# Altium schematic sheet PCBSchematic.SchDoc
size A
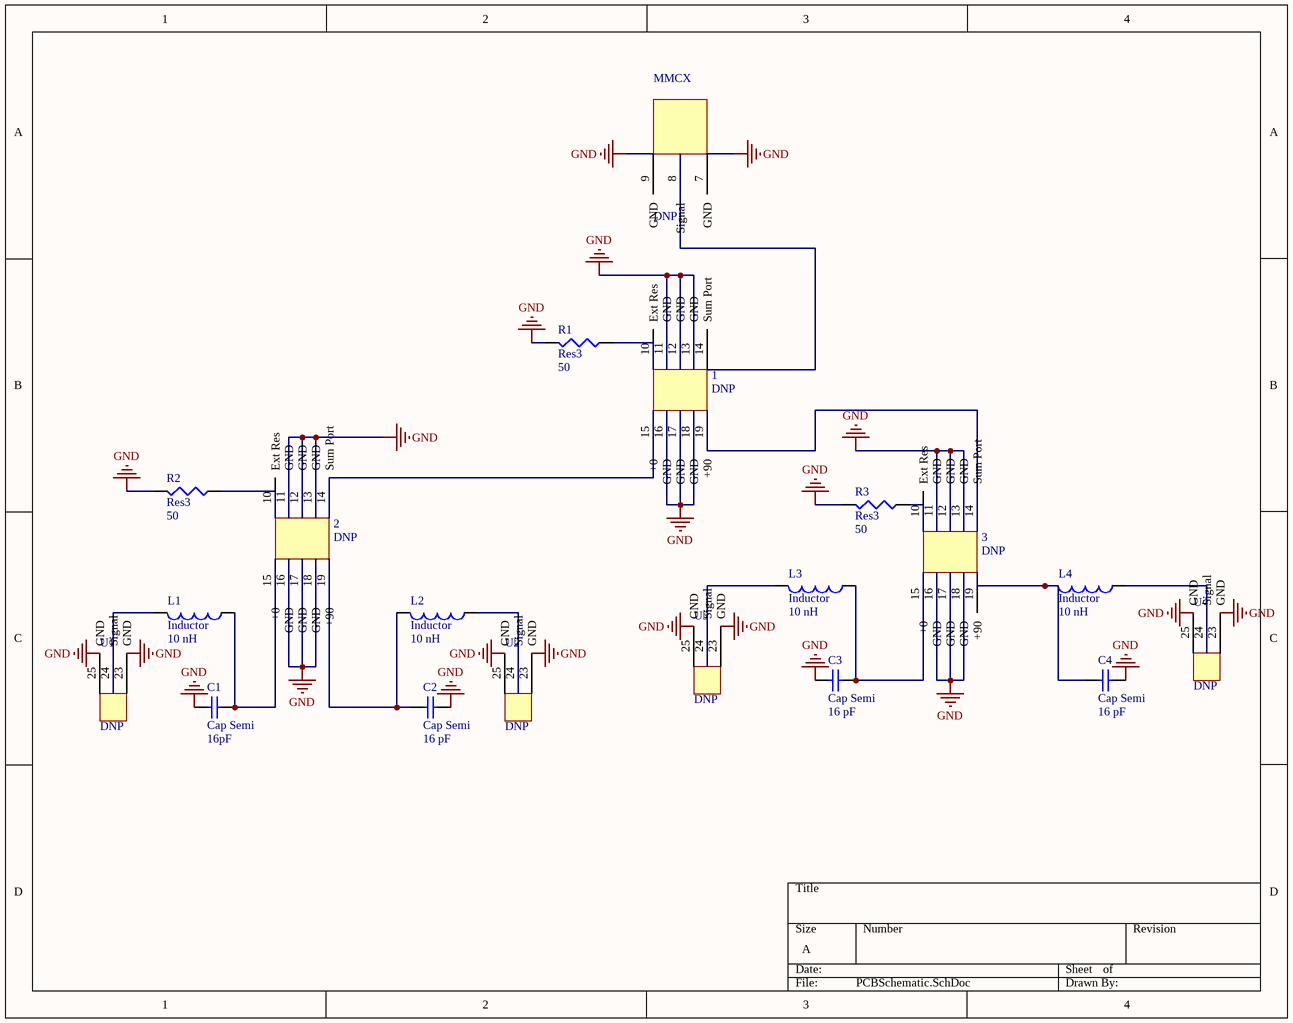
[diagram p0: PCBSchematic.SchDoc]

## Parts
1  DNP  [QBA07]
2  DNP  [QBA07]
3  DNP  [QBA07]
C1  Cap Semi  value 16pF  [1608[0603]]
C2  Cap Semi  value 16 pF  [1608[0603]]
C3  Cap Semi  value 16 pF  [1608[0603]]
C4  Cap Semi  value 16 pF  [1608[0603]]
L1  Inductor  value 10 nH  [2029]
L2  Inductor  value 10 nH  [2029]
L3  Inductor  value 10 nH  [2029]
L4  Inductor  value 10 nH  [2029]
MMCX  DNP  [MMCX]
R1  Res3  value 50  [J1-0603]
R2  Res3  value 50  [J1-0603]
R3  Res3  value 50  [J1-0603]
U1  DNP  [U.fl]
U2  DNP  [U.fl]
U3  DNP  [U.fl]
U4  DNP  [U.fl]

## Nets
GND: 1.11(GND) 1.12(GND) 1.13(GND) 1.16(GND) 1.17(GND) 1.18(GND) 2.11(GND) 2.12(GND) 2.13(GND) 2.16(GND) 2.17(GND) 2.18(GND) 3.11(GND) 3.12(GND) 3.13(GND) 3.16(GND) 3.17(GND) 3.18(GND) C1.2 C2.1 C3.2 C4.1 MMCX.7(GND) MMCX.9(GND) R1.2 R2.2 R3.2
Net1_10: 1.10(Ext_Res) R1.1
Net1_14: 1.14(Sum_Port) MMCX.8(Signal)
Net1_15: 1.15(+0) 2.14(Sum_Port)
Net1_19: 1.19(+90) 3.14(Sum_Port)
Net2_10: 2.10(Ext_Res) R2.1
Net2_15: 2.15(+0) C1.1 L1.1
Net2_19: 2.19(+90) C2.2 L2.2
Net3_10: 3.10(Ext_Res) R3.1
Net3_15: 3.15(+0) C3.1 L3.1
Net3_19: 3.19(+90) C4.2 L4.2
NetL1_2: L1.2 U1.24(Signal)
NetL2_1: L2.1 U2.24(Signal)
NetL3_2: L3.2 U3.24(Signal)
NetL4_1: L4.1 U4.24(Signal)

Not connected (* = marked no-connect by the designer): U1 23(GND) 25(GND); U2 23(GND) 25(GND); U3 23(GND) 25(GND); U4 23(GND) 25(GND)

## Notes on the sheet
- Labels drawn without touching a wire or pin: GND

## Library data of the parts
1-3 = QBA-07
C1-C4 = Cap Semi: Capacitor (Semiconductor SIM Model); Published: 8-Jun-2000; LatestRevisionDate: 29-May-2009; LatestRevisionNote: IPC-7351 Footprint Added.; PackageReference: C1206; Publisher: Altium Limited; PackageDescription: Chip Capacitor
L1-L4 = Inductor: Code_IEC: 1005; Published: 8-Jun-2000; LatestRevisionDate: 29-May-2009; LatestRevisionNote: IPC-7351 Footprint Added.; PackageReference: 0402-A; Publisher: Altium Limited; PackageDescription: Chip Inductor; Code_JEITA: 0402
MMCX = MMCX Jack
R1-R3 = Res3: Resistor; Published: 8-Jun-2000; LatestRevisionDate: 29-May-2009; LatestRevisionNote: IPC-7351 Footprint Added.; PackageReference: J1-0603; Publisher: Altium Limited; PackageDescription: Chip Resistor
U1-U4 = U.fl